# EAGLE design stm32-board-adapter (EAGLE 7.7.0)
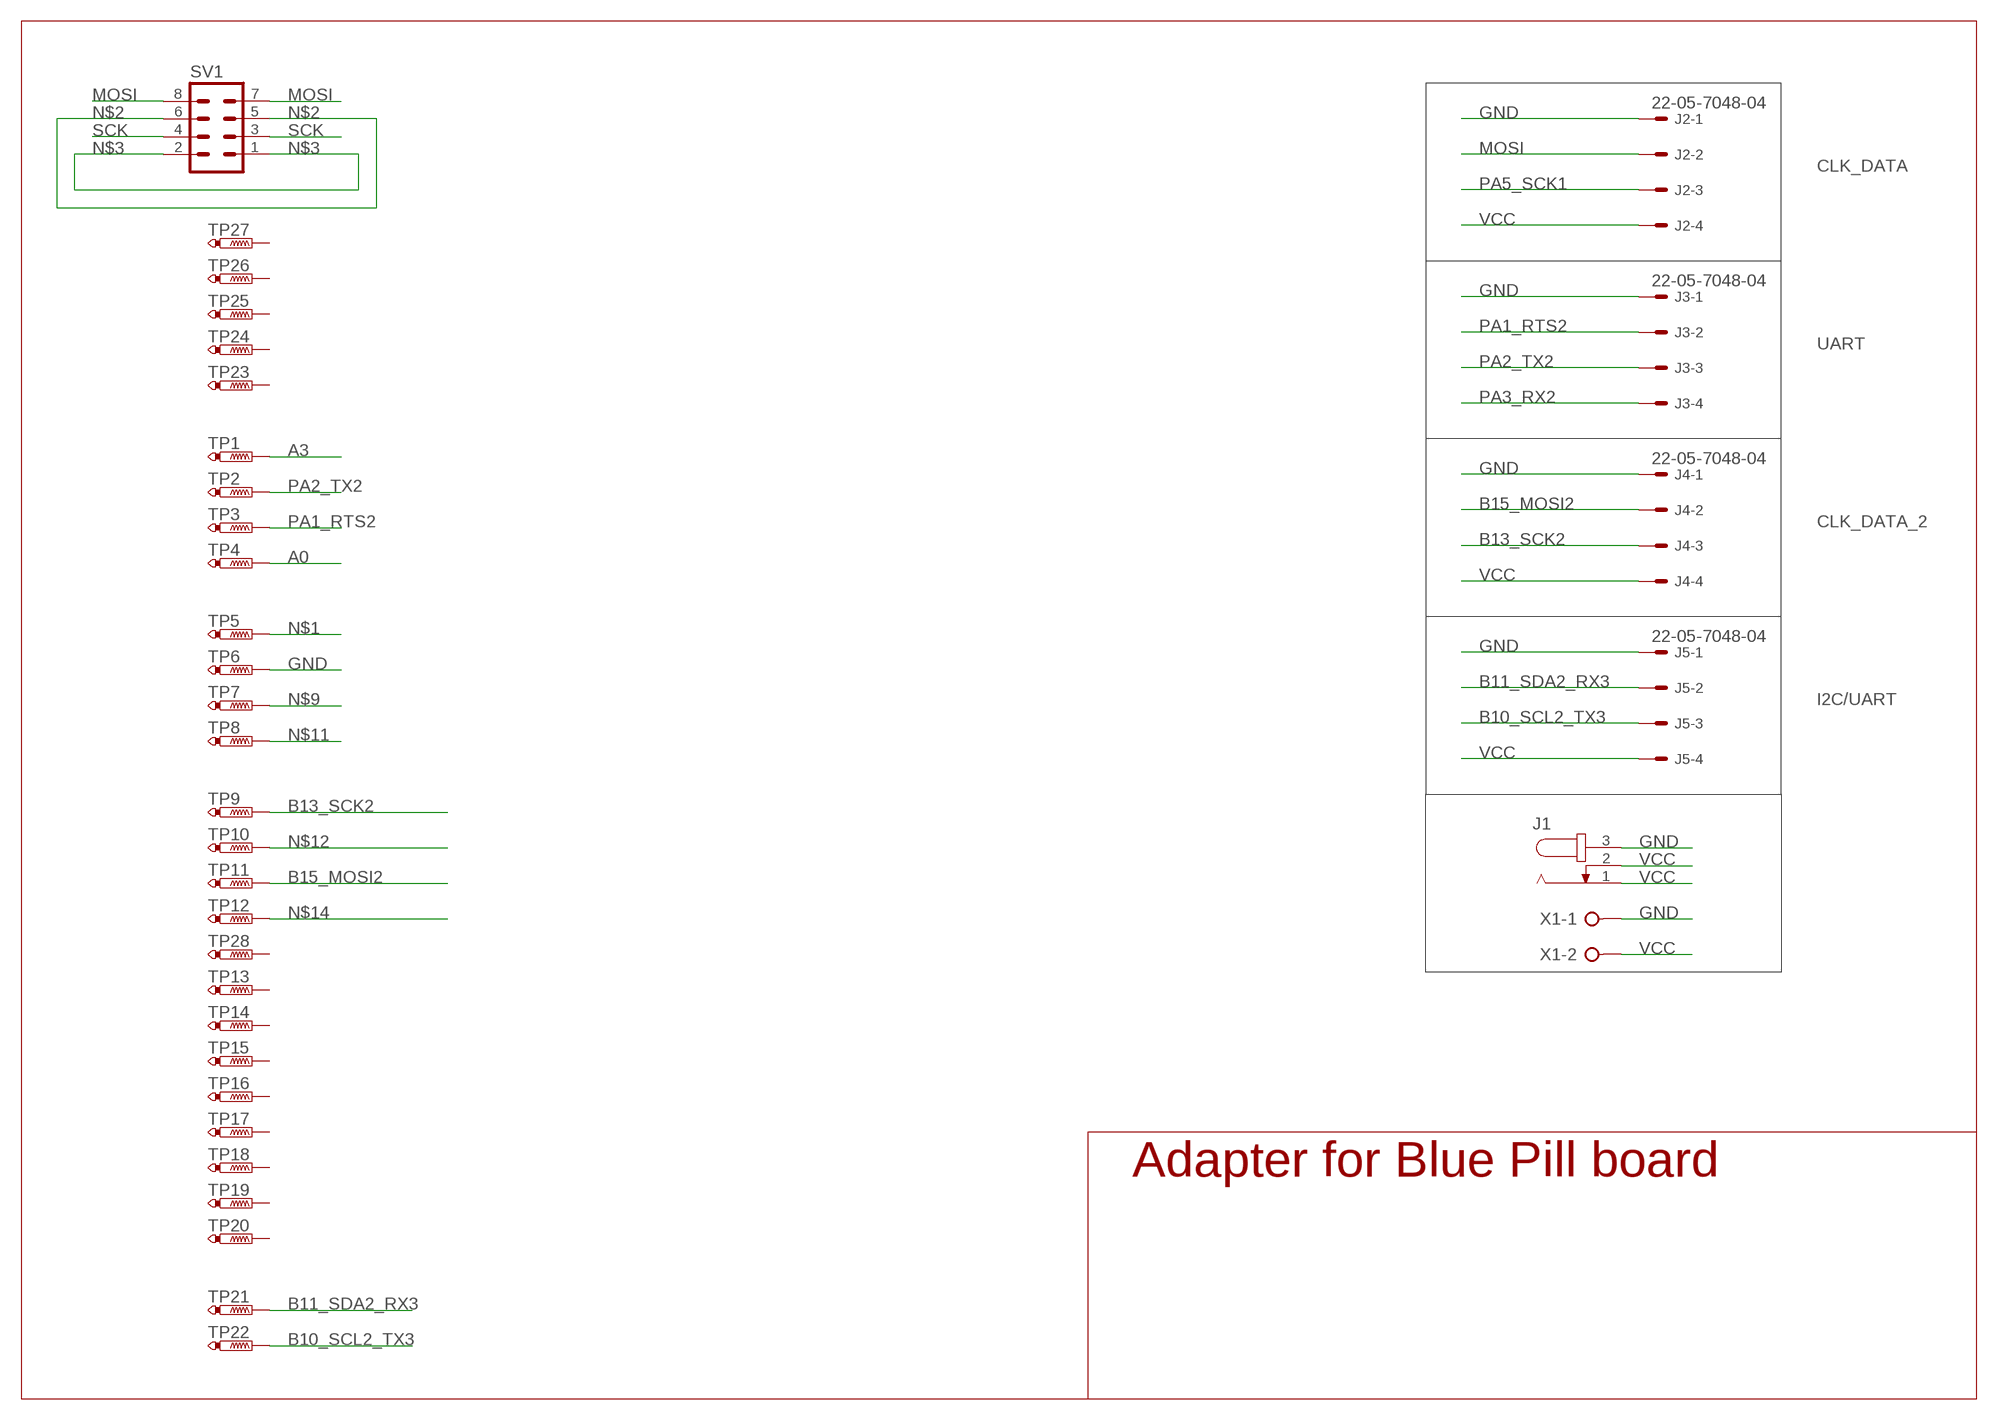
[diagram p0: schematic, sheet 1]

## Parts
J1  JACK-PLUG1  [SPC4078]
J2  22-05-7048-04  [7395-04]
J3  22-05-7048-04  [7395-04]
J4  22-05-7048-04  [7395-04]
J5  22-05-7048-04  [7395-04]
SV1  MA04-2  [MA04-2]
TP1  PTR1PAD1-13  [P1-13]
TP2  PTR1PAD1-13  [P1-13]
TP3  PTR1PAD1-13  [P1-13]
TP4  PTR1PAD1-13  [P1-13]
TP5  PTR1PAD1-13  [P1-13]
TP6  PTR1PAD1-13  [P1-13]
TP7  PTR1PAD1-13  [P1-13]
TP8  PTR1PAD1-13  [P1-13]
TP9  PTR1PAD1-13  [P1-13]
TP10  PTR1PAD1-13  [P1-13]
TP11  PTR1PAD1-13  [P1-13]
TP12  PTR1PAD1-13  [P1-13]
TP13  PTR1PAD1-13  [P1-13]
TP14  PTR1PAD1-13  [P1-13]
TP15  PTR1PAD1-13  [P1-13]
TP16  PTR1PAD1-13  [P1-13]
TP17  PTR1PAD1-13  [P1-13]
TP18  PTR1PAD1-13  [P1-13]
TP19  PTR1PAD1-13  [P1-13]
TP20  PTR1PAD1-13  [P1-13]
TP21  PTR1PAD1-13  [P1-13]
TP22  PTR1PAD1-13  [P1-13]
TP23  PTR1PAD1-13  [P1-13]
TP24  PTR1PAD1-13  [P1-13]
TP25  PTR1PAD1-13  [P1-13]
TP26  PTR1PAD1-13  [P1-13]
TP27  PTR1PAD1-13  [P1-13]
TP28  PTR1PAD1-13  [P1-13]
X1  W237-02P  [W237-132]

## Nets
A0: TP4.TP
A3: TP1.TP
B10_SCL2_TX3: J5.3 TP22.TP
B11_SDA2_RX3: J5.2 TP21.TP
B13_SCK2: J4.3 TP9.TP
B15_MOSI2: J4.2 TP11.TP
GND: J1.3 J2.1 J3.1 J4.1 J5.1 TP6.TP X1.1
MOSI: J2.2 SV1.7 SV1.8
N$1: TP5.TP
N$2: SV1.5 SV1.6
N$3: SV1.1 SV1.2
N$9: TP7.TP
N$11: TP8.TP
N$12: TP10.TP
N$14: TP12.TP
PA1_RTS2: J3.2 TP3.TP
PA2_TX2: J3.3 TP2.TP
PA3_RX2: J3.4
PA5_SCK1: J2.3
SCK: SV1.3 SV1.4
VCC: J1.1 J1.2 J2.4 J4.4 J5.4 X1.2
Unconnected: TP13.TP TP14.TP TP15.TP TP16.TP TP17.TP TP18.TP TP19.TP TP20.TP TP23.TP TP24.TP TP25.TP TP26.TP TP27.TP TP28.TP

## Notes on the sheet
- CLK_DATA
- UART
- CLK_DATA_2
- I2C/UART
- Adapter for Blue Pill board

## Library data of the parts
J1 = con-jack:JACK-PLUG: DC POWER JACK Power Jack, DC, Right Angle, Through Hole, Rated 5A at 16VDC, PC Terminals Distributor: Farnell (www.Farnell.de) Drawing: 84N1161.pdf / 84N1162.pdf Manufacturer: SPC Technology (www.spctechnology.com) Type: SPC4077 / SPC 4078; OC_FARNELL: unknown; OC_NEWARK: unknown
J2-J5 = con-molex:22-?-04: CONNECTOR wire to board 2.54 mm (.1 inch) pitch header; OC_FARNELL: unknown; OC_NEWARK: unknown
SV1 = con-lstb:MA04-2: PIN HEADER; OC_FARNELL: unknown; OC_NEWARK: unknown
TP1-TP28 = testpad:PTR1: TEST PIN
X1 = con-wago-508:W237-02P: WAGO SREW CLAMP; OC_FARNELL: unknown; OC_NEWARK: unknown

## Board
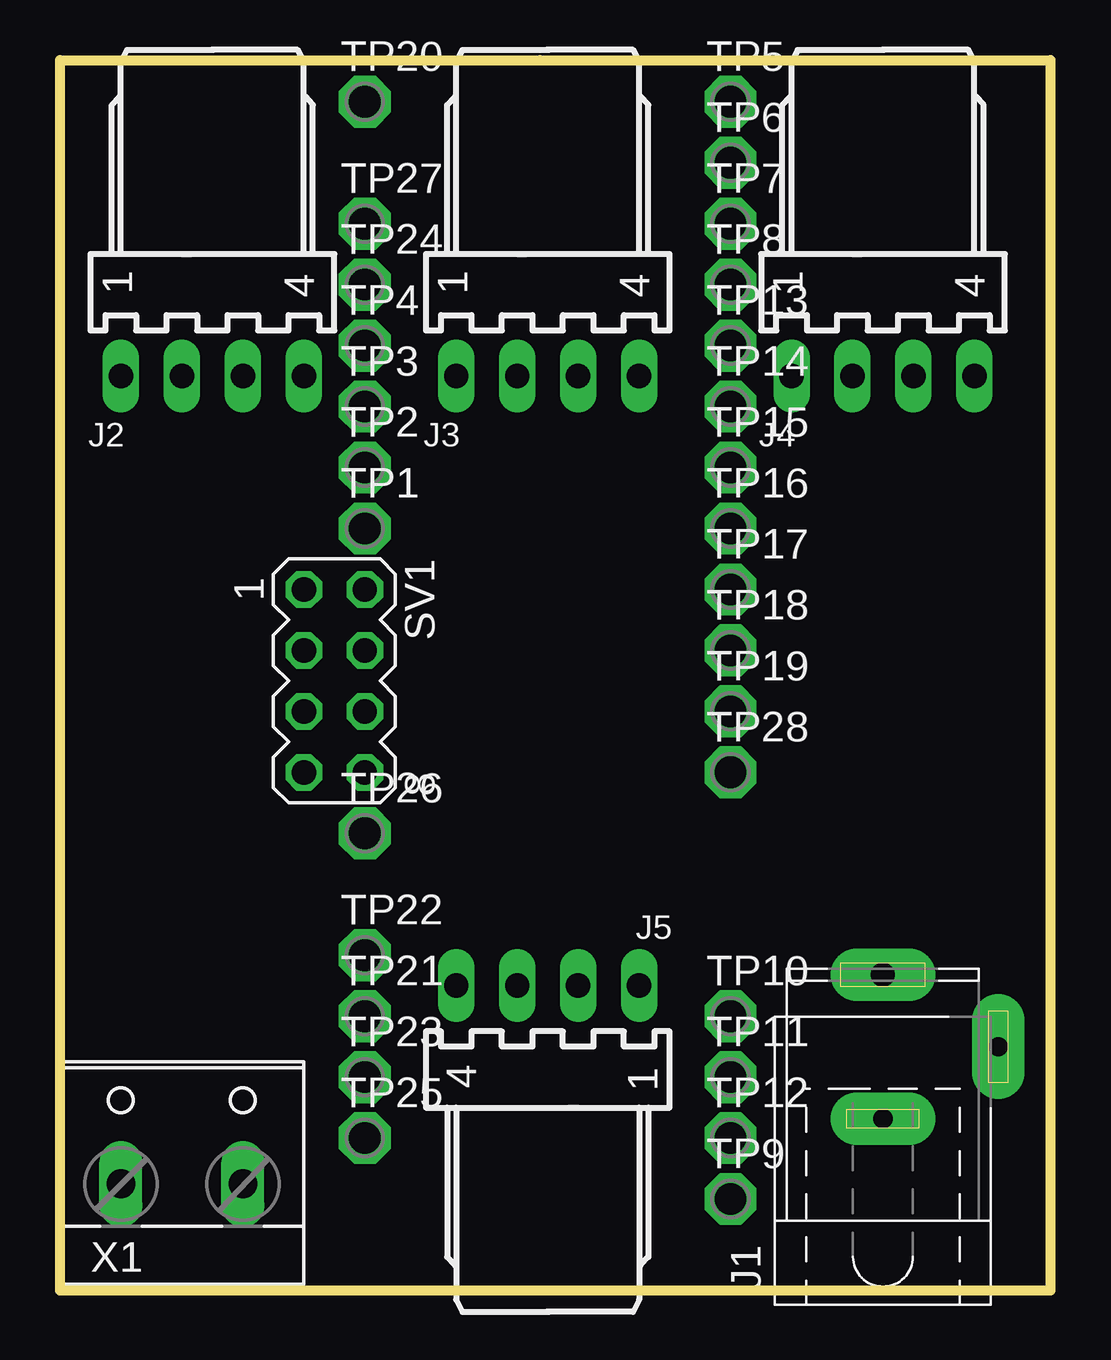
[diagram p1: board, top side]
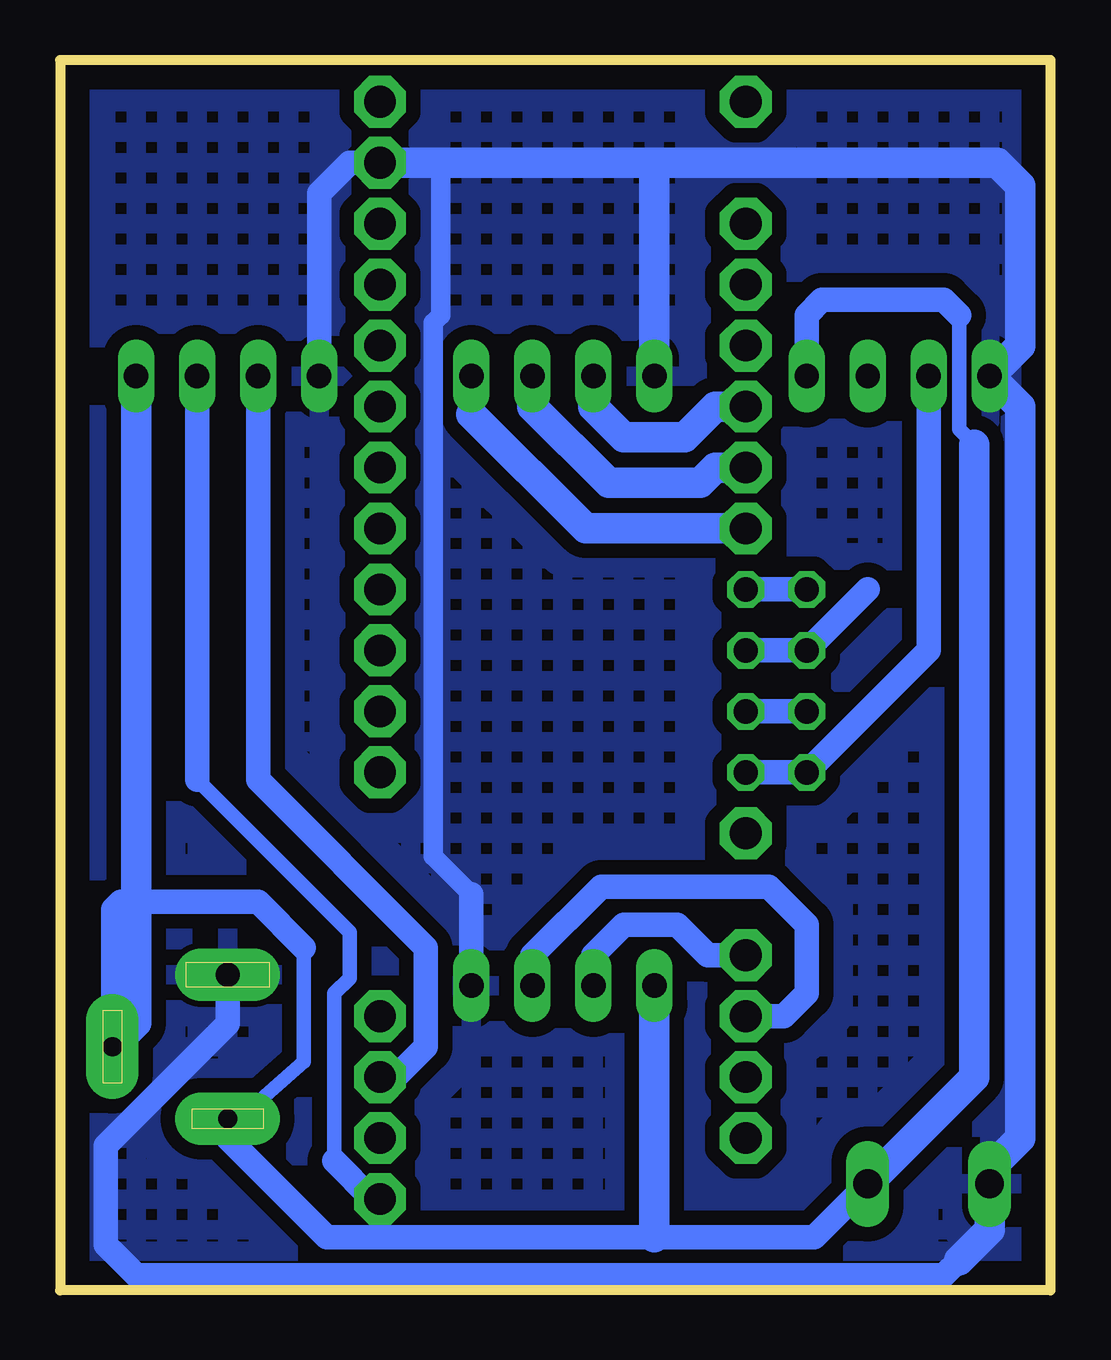
[diagram p2: board, bottom side, seen from below]

Size 41.27 x 51.27 mm. Coordinates in mm from the lower left corner, seen from the top.
Outline: 20,51.27 0,51.27 0,0 41.27,0 41.27,51.27 20,51.27
Outline: 20,51.27 20,51.27
Copper layers (1*16): Top 0.035mm / dielectric 1.5mm / Bottom 0.035mm
Design rules "default": minimum track width 10mil, minimum drill 24mil, track to track 8mil, track to pad 8mil, pad to pad 8mil, via to via 8mil, smd to smd 8mil, copper to edge 40mil, drill to drill 8mil, minimum pad ring 10mil, minimum via ring 8mil, stop-mask expansion 4mil, vias tented up to drill 0mil, thermal gap 10mil

### Footprints (pad centres in the part's own frame; a part is rotated, then mirrored left to right if it is on the bottom)
SPC4078 = drill 0.8 pad 2.184 long: 1 -3,0; 2 0,-4.8 | drill 1 pad 2.184 long: 3 3,0
7395-04 = drill 1.016 long: 1 3.81,0; 2 1.27,0; 3 -1.27,0; 4 -3.81,0
MA04-2 = drill 1.016 octagon: 1 -3.81,-1.27; 2 -3.81,1.27; 3 -1.27,-1.27; 4 -1.27,1.27; 5 1.27,-1.27; 6 1.27,1.27; 7 3.81,-1.27; 8 3.81,1.27
P1-13 = drill 1.321 pad 2.159 octagon: TP 0,0
W237-132 = drill 1.194 long: 1 -2.54,-0.635; 2 2.54,-0.635

### Placement (x,y rotation side)
J1  34.29,10.16 90 top
J2  6.35,38.1 180 top
J3  20.32,38.1 180 top
J4  34.29,38.1 180 top
J5  20.32,12.7 0 top
SV1  11.43,25.4 270 top
TP1  12.7,31.75 0 top
TP2  12.7,34.29 0 top
TP3  12.7,36.83 0 top
TP4  12.7,39.37 0 top
TP5  27.94,49.53 0 top
TP6  27.94,46.99 0 top
TP7  27.94,44.45 0 top
TP8  27.94,41.91 0 top
TP9  27.94,3.81 0 top
TP10  27.94,11.43 0 top
TP11  27.94,8.89 0 top
TP12  27.94,6.35 0 top
TP13  27.94,39.37 0 top
TP14  27.94,36.83 0 top
TP15  27.94,34.29 0 top
TP16  27.94,31.75 0 top
TP17  27.94,29.21 0 top
TP18  27.94,26.67 0 top
TP19  27.94,24.13 0 top
TP20  12.7,49.53 0 top
TP21  12.7,11.43 0 top
TP22  12.7,13.97 0 top
TP23  12.7,8.89 0 top
TP24  12.7,41.91 0 top
TP25  12.7,6.35 0 top
TP26  12.7,19.05 0 top
TP27  12.7,44.45 0 top
TP28  27.94,21.59 0 top
X1  5.08,5.08 0 top

### Tracks (layer width: path | path; a pad name or v marks a point on that pad's centre or on a via)
A3
  Bottom 1.27: TP1.TP 19.37,31.75 24.13,36.51
B10_SCL2_TX3
  Bottom 0.813: 19.05,13.97 J5.3
  Bottom 1.016: 19.05,13.97 17.78,15.24 15.56,15.24 14.29,13.97 TP22.TP
B11_SDA2_RX3
  Bottom 0.813: 21.59,13.97 J5.2
  Bottom 1.016: 21.59,13.97 18.73,16.83 11.75,16.83 10.16,15.24 10.16,12.38 11.11,11.43 TP21.TP
B13_SCK2
  Bottom 0.61: 29.84,5.4 29.84,12.38 29.21,13.02 29.21,14.92 35.56,21.27
  Bottom 1.016: TP9.TP 28.26,3.81 29.84,5.4 | J4.3 35.56,21.27
B15_MOSI2
  Bottom 1.016: TP11.TP 27.3,8.89 26.04,10.16 26.04,14.29 33.02,21.27 J4.2
GND
  Bottom 0.813: 24.13,16.51 25.72,18.1 25.72,40.32 25.4,40.64 25.4,46.99
  Bottom 1.016: J1.3 34.29,11.11 39.37,6.03 39.37,1.91 38.1,0.64 4.45,0.64 3.81,1.27 | J5.1 24.13,16.51 | J4.1 30.48,45.72 29.21,46.99 TP6.TP
  Bottom 1.27: 3.81,1.27 2.54,2.54 X1.1 2.54,5.08 1.27,6.35 1.27,36.83 J2.1 1.27,39.37 1.27,46.04 2.22,46.99 16.51,46.99 | J3.1 16.51,46.99 | 16.51,46.99 25.4,46.99 TP6.TP
  pour Bottom (isolate 0.61, hatched): 0,0 40.64,0 40.64,50.8 0,50.8
MOSI
  Bottom 1.016: J2.2 5.08,26.67 SV1.7 SV1.8
N$2
  Bottom 1.016: SV1.6 SV1.5
N$3
  Bottom 1.016: SV1.2 SV1.1
PA1_RTS2
  Bottom 1.27: TP3.TP 13.97,36.83 15.24,35.56 17.78,35.56 19.05,36.83 J3.2
PA2_TX2
  Bottom 1.27: TP2.TP 13.97,34.29 14.61,33.66 18.41,33.66 21.59,36.83 J3.3
SCK
  Bottom 1.016: 7.62,29.21 SV1.3 SV1.4
VCC
  Bottom 0.61: 31.11,14.29 31.11,9.53 33.8,7.16 | 3.81,40.64 3.81,35.88 3.17,35.24
  Bottom 1.016: X1.2 9.84,2.22 16.51,2.22 30.16,2.22 34.29,6.35 J1.1 33.8,7.16 | J1.2 39.05,10.2 39.05,15.88 38.73,16.19 33.02,16.19 31.11,14.29 | J2.4 10.16,40.64 9.53,41.27 4.45,41.27 3.81,40.64
  Bottom 1.27: 3.17,35.24 3.17,8.89 X1.2 | 39.37,10.44 J1.2 38.1,11.15 J4.4 | J5.4 16.51,2.22

### Text on the board
Document: CLK_DATA | UART | CLK_DATA_2 | P_SUPP | I2C / UART | P_SUPP